# EAGLE design AE-AQM0802-board (EAGLE 6.3)
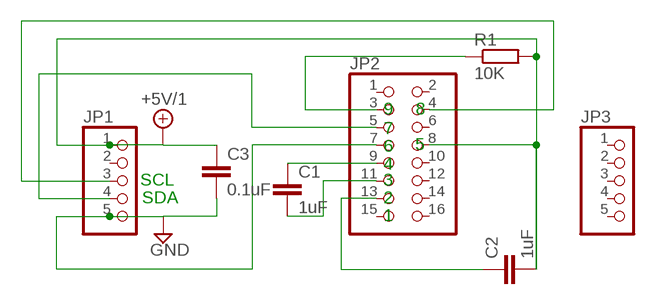
[diagram p0: schematic, sheet 1]

## Parts
C1  1uF  C-EUC0504  [C0504]
C2  1uF  C-EUC0504  [C0504]
C3  0.1uF  C-EUC0504  [C0504]
JP1  PINHD-1X5  [1X05]
JP2  PINHD-2X8  [2X08]
JP3  PINHD-1X5  [1X05]
R1  10K  R-EU_M2012  [M2012]

## Nets
+5V/1: C2.2 C3.1 JP1.1 JP2.8 R1.2
GND: C3.2 JP1.5 JP2.7
N$1: C1.2 JP2.11
N$2: C2.1 JP2.13
N$3: C1.1 JP2.9
N$4: JP2.3 R1.1
N$6: JP1.3 JP2.4
N$7: JP1.4 JP2.5
Unconnected: JP1.2 JP2.1 JP2.2 JP2.6 JP2.10 JP2.12 JP2.14 JP2.15 JP2.16 JP3.1 JP3.2 JP3.3 JP3.4 JP3.5

## Notes on the sheet
- 9 | 8
- 7
- 6 | 5
- 4
- SCL | 3
- SDA | 2
- 1

## Library data of the parts
C1-C3 = rcl:C-EU: CAPACITOR, European symbol
JP1 JP3 = pinhead:PINHD-1X5: PIN HEADER
JP2 = pinhead:PINHD-2X8: PIN HEADER
R1 = resistor:R-EU_: RESISTOR, European symbol

## Board
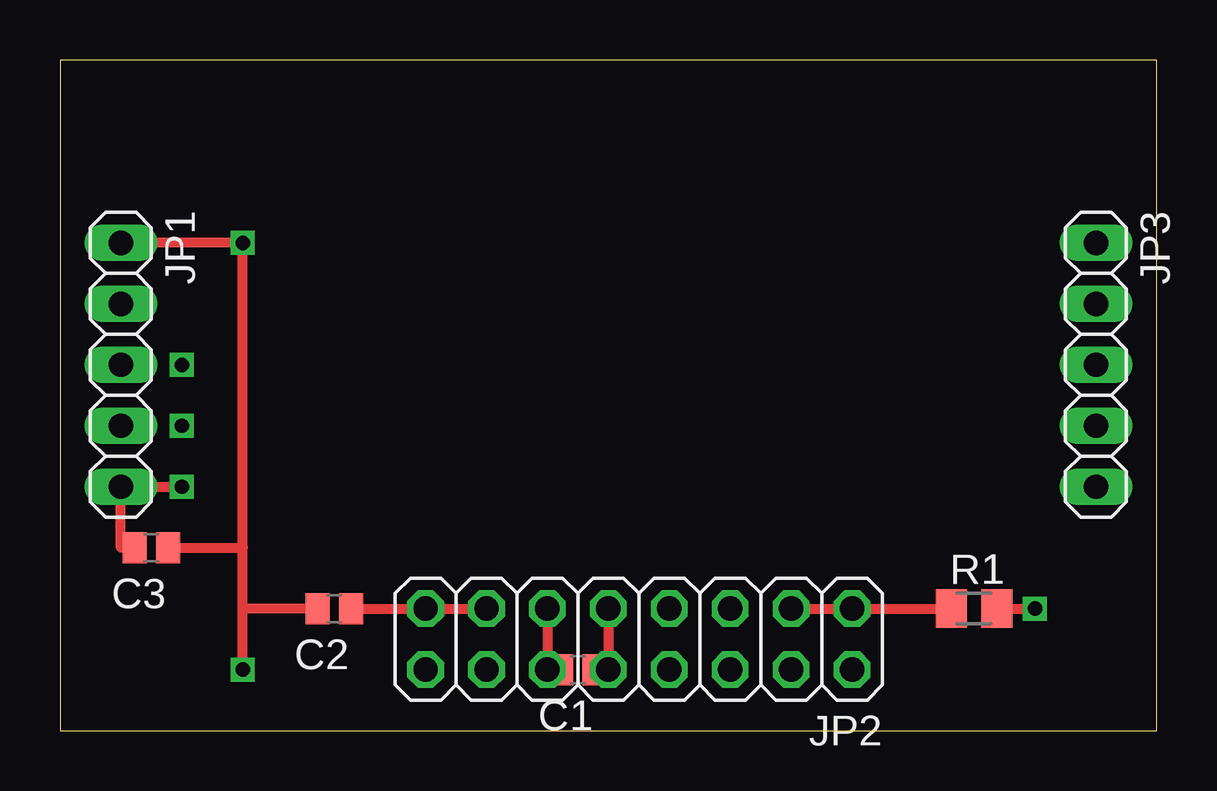
[diagram p1: board, top side]
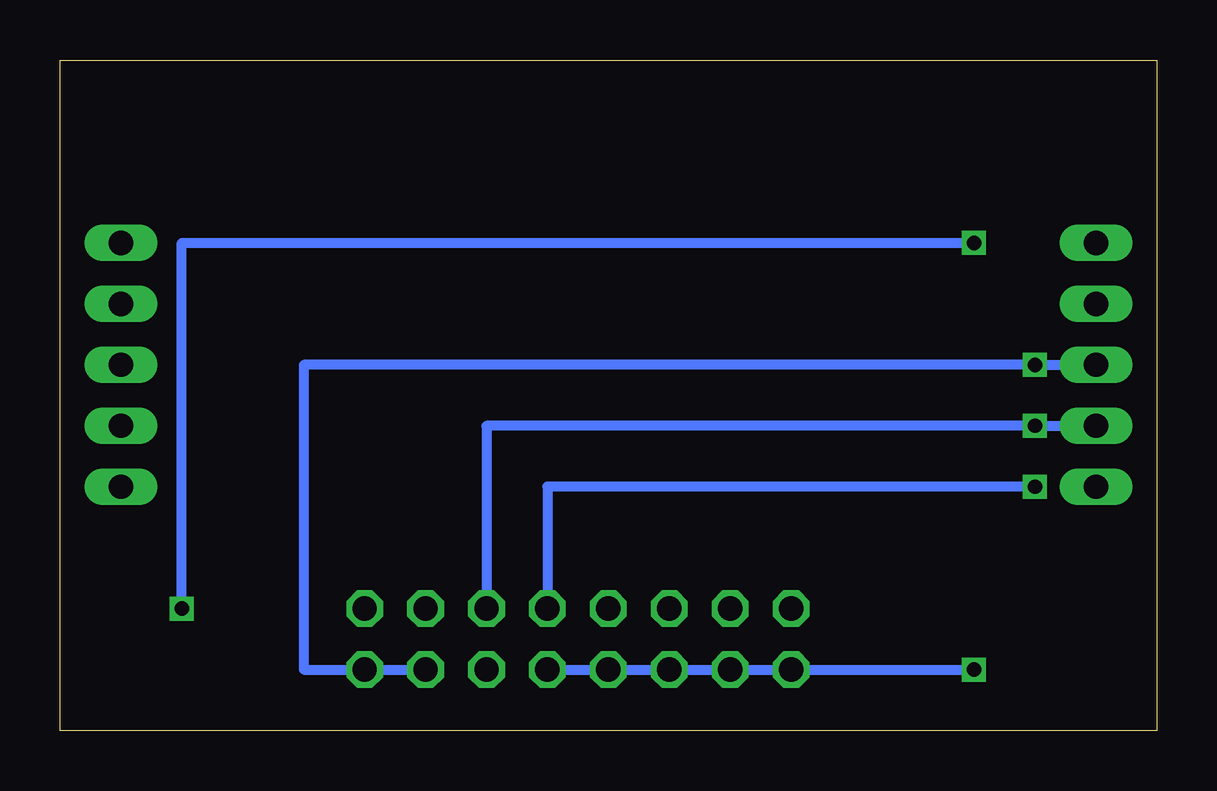
[diagram p2: board, bottom side, seen from below]

Size 45.72 x 27.94 mm. Coordinates in mm from the lower left corner, seen from the top.
Outline: 0,0 45.72,0 45.72,27.94 0,27.94 0,0
Copper layers (1*16): Top 0.035mm / dielectric 1.5mm / Bottom 0.035mm
Design rules "default": minimum track width 10mil, minimum drill 24mil, track to track 8mil, track to pad 8mil, pad to pad 8mil, via to via 8mil, smd to smd 8mil, copper to edge 40mil, drill to drill 8mil, minimum pad ring 10mil, minimum via ring 8mil, stop-mask expansion 4mil, vias tented up to drill 0mil, thermal gap 10mil
tRestrict: area 9.3,7 to 39.3,26.5

### Footprints (pad centres in the part's own frame; a part is rotated, then mirrored left to right if it is on the bottom)
C0504 = smd 1 x 1.3: 1 -0.7,0; 2 0.7,0
1X05 = drill 1.016 long: 1 -5.08,0; 2 -2.54,0; 3 0,0; 4 2.54,0; 5 5.08,0
2X08 = drill 1.016 octagon: 1 -8.89,-1.27; 2 -8.89,1.27; 3 -6.35,-1.27; 4 -6.35,1.27; 5 -3.81,-1.27; 6 -3.81,1.27; 7 -1.27,-1.27; 8 -1.27,1.27; 9 1.27,-1.27; 10 1.27,1.27; 11 3.81,-1.27; 12 3.81,1.27; 13 6.35,-1.27; 14 6.35,1.27; 15 8.89,-1.27; 16 8.89,1.27
M2012 = smd 1.3 x 1.6: 1 -0.95,0; 2 0.95,0

### Placement (x,y rotation side)
C1  21.59,2.54 180 top
C2  11.43,5.08 180 top
C3  3.81,7.62 180 top
JP1  2.54,15.24 270 top
JP2  24.13,3.81 180 top
JP3  43.18,15.24 270 top
R1  38.1,5.08 0 top

### Tracks (layer width: path | path; a pad name or v marks a point on that pad's centre or on a via)
+5V/1  (via drill 0.6)
  Top 0.406: v7.62,2.54 7.62,5.08 | 7.62,5.08 7.62,7.62 | 7.62,7.62 v7.62,20.32 JP1.1 | C3.1 7.62,7.62 | C2.2 7.62,5.08 | R1.2 v40.64,5.08
  Bottom 0.406: JP2.8 v7.62,2.54 | v7.62,20.32 40.64,20.32 v40.64,5.08
GND  (via drill 0.6)
  Top 0.406: C3.2 2.54,7.62 JP1.5 v5.08,10.16
  Bottom 0.406: v5.08,10.16 25.4,10.16 JP2.7
N$1
  Top 0.406: JP2.11 20.32,2.54 C1.2
N$2
  Top 0.406: C2.1 JP2.13
N$3
  Top 0.406: JP2.9 22.86,2.54 C1.1
N$4
  Top 0.406: JP2.3 R1.1
N$6  (via drill 0.6)
  Bottom 0.406: JP2.4 35.56,2.54 35.56,15.24 v5.08,15.24 JP1.3
N$7  (via drill 0.6)
  Bottom 0.406: JP2.5 27.94,12.7 v5.08,12.7 JP1.4